# EasyEDA Pro project ProPrj_USB Hub Port PCB_2026-08-16.epro

# Schematic Schematic1
Board Name: Board1; Create Date: 2026-04-19; Page Name: P1; Project Name: USB Hub Port PCB; Schematic Name: Schematic1; Update Date: 2026-04-21; Company: EasyEDA.com; Page Size: A4; Version: V1.0
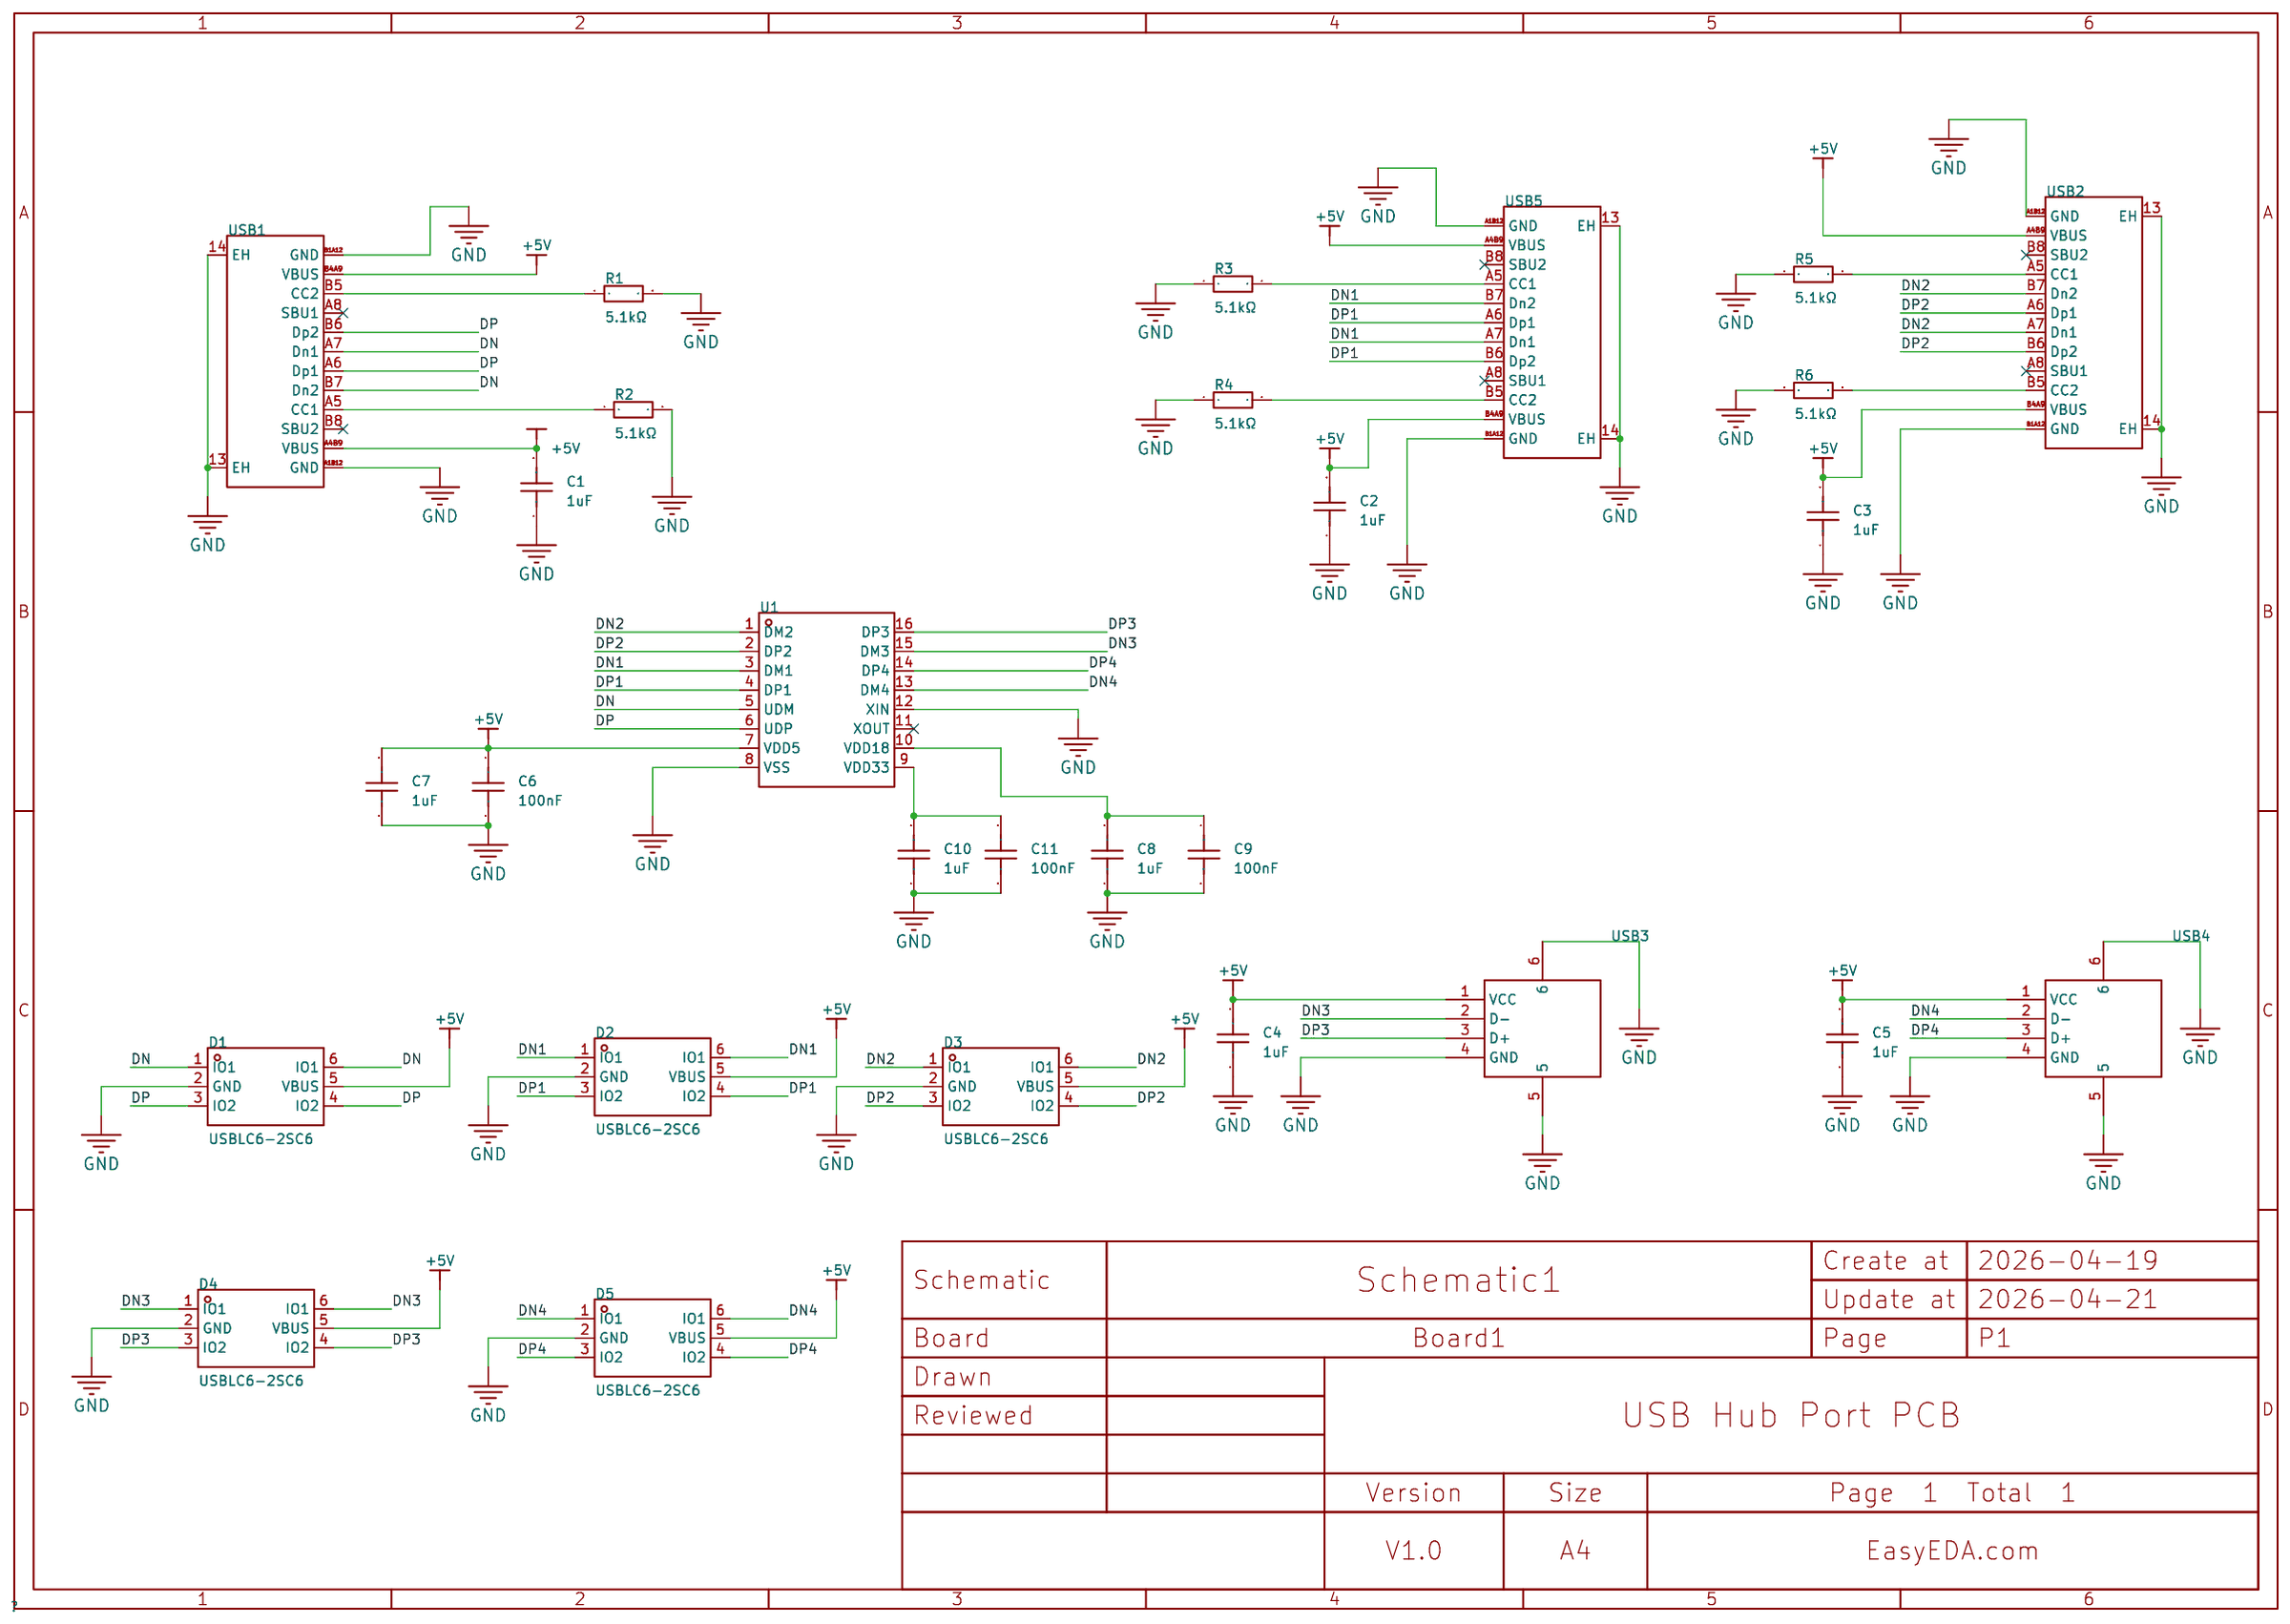
[diagram p0: schematic sheet]

## Parts
C1  1uF  [C0603]
C2  1uF  [C0603]
C3  1uF  [C0603]
C4  1uF  [C0603]
C5  1uF  [C0603]
C6  100nF  [C0603]
C7  1uF  [C0603]
C8  1uF  [C0603]
C9  100nF  [C0603]
C10  1uF  [C0603]
C11  100nF  [C0603]
D1  USBLC6-2SC6  [SOT-23-6_L2.9-W1.6-P0.95-LS2.8-BL]
D2  USBLC6-2SC6  [SOT-23-6_L2.9-W1.6-P0.95-LS2.8-BL]
D3  USBLC6-2SC6  [SOT-23-6_L2.9-W1.6-P0.95-LS2.8-BL]
D4  USBLC6-2SC6  [SOT-23-6_L2.9-W1.6-P0.95-LS2.8-BL]
D5  USBLC6-2SC6  [SOT-23-6_L2.9-W1.6-P0.95-LS2.8-BL]
R1  5.1kΩ  [R0603]
R2  5.1kΩ  [R0603]
R3  5.1kΩ  [R0603]
R4  5.1kΩ  [R0603]
R5  5.1kΩ  [R0603]
R6  5.1kΩ  [R0603]
U1  SL2.1s  [SSOP-16_L4.6-W2.6-P0.53-LS4.0-BL]
USB1  TYPE-C 16PIN 2MD(073)  [USB-C-SMD_TYPE-C-16PIN-2MD-073]
USB2  TYPE-C 16PIN 2MD(073)  [USB-C-SMD_TYPE-C-16PIN-2MD-073]
USB3  10.0 QHHTZB6.3  [USB-A-TH_10.0QHHTZB6.3]
USB4  10.0 QHHTZB6.3  [USB-A-TH_10.0QHHTZB6.3]
USB5  TYPE-C 16PIN 2MD(073)  [USB-C-SMD_TYPE-C-16PIN-2MD-073]

## Library data of the parts
C1-C5 C7 C8 C10 = CL10A105KB8NNNC: Capacitance:1uF Tolerance:±10% Tolerance:±10% Voltage Rating:50V Temperature Coefficient:X5R; LCSC Part Name: 1uF ±10% 50V; Supplier Part: C15849; Manufacturer: SAMSUNG(三星); Supplier Footprint: 0603; JLCPCB Part Class: Basic Part; Datasheet: https://item.szlcsc.com/datasheet/CL10A105KB8NNNC/16531.html; Supplier: LCSC; Tolerance: ±10%; Voltage Rating: 50V; Temperature Coefficient: X5R; PCB Layer: TopLayer
C6 C9 C11 = CL10B104KB8NNNC: Capacitance:100nF Tolerance:±10% Tolerance:±10% Voltage Rating:50V Temperature Coefficient:X7R; LCSC Part Name: 100nF ±10% 50V; Supplier Part: C1591; Manufacturer: SAMSUNG(三星); Supplier Footprint: 0603; JLCPCB Part Class: Extended Part; Datasheet: https://item.szlcsc.com/datasheet/CL10B104KB8NNNC/1943.html; Supplier: LCSC; Tolerance: ±10%; Voltage Rating: 50V; Temperature Coefficient: X7R; PCB Layer: TopLayer
D1-D5 = USBLC6-2SC6_C2827654: Polarity:Unidirectional Reverse Stand-Off Voltage (Vrwm):5V Clamping Voltage:12V Peak Pulse Current (Ipp):6A Peak Pulse Power Dissipation (Ppp):150W Voltage - Breakdown:6V Reverse Leakage Current (Ir):80nA Number of Channels:2 Operating Temperature:-55℃~+; LCSC Part Name: ESD，可防30kV静电; Supplier Part: C2827654; Manufacturer: TECH PUBLIC(台舟); Supplier Footprint: SOT-23-6; JLCPCB Part Class: Extended Part; Datasheet: https://item.szlcsc.com/datasheet/USBLC6-2SC6/2973336.html; Supplier: LCSC; Polarity: Unidirectional; Reverse Stand-Off Voltage (Vrwm): 5V; Clamping Voltage: 12V; Peak Pulse Current (Ipp): 6A; Peak Pulse Power Dissipation (Ppp): 150W; Voltage - Breakdown: 6V; Reverse Leakage Current (Ir): 80nA; Number of Channels: 2; Operating Temperature: -55℃~+125℃; level of protection: IEC 61000-4-2；IEC 61000-4-4；IEC 61000-4-5; Type: ESD; Junction Capacitance: 0.35pF
R1-R6 = 0603WAF5101T5E: Type:Thick Film Resistor Resistance:5.1kΩ Tolerance:±1% Tolerance:±1% Power(Watts):100mW Voltage-Supply(Max):75V Temperature Coefficient:±100ppm/℃ Temperature Coefficient:±100ppm/℃ Operating Temperature:-55℃~+155℃ Operating Temperature:-55℃~+155℃; LCSC Part Name: 5.1kΩ ±1% 100mW 厚膜电阻; Supplier Part: C23186; Manufacturer: UNI-ROYAL(厚声); Supplier Footprint: 0603; JLCPCB Part Class: Basic Part; Datasheet: https://item.szlcsc.com/datasheet/0603WAF5101T5E/23913.html; Supplier: LCSC; Type: Thick Film Resistor; Tolerance: ±1%; Power(Watts): 100mW; Voltage-Supply(Max): 75V; Temperature Coefficient: ±100ppm/℃; Operating Temperature: -55℃~+155℃
U1 = SL2.1s: type:Hub USB Protocol:USB 2.0 Data Rate:- Voltage - Supply:4V~5.25V Voltage - Supply:4V~5.25V Operating Temperature:0℃~+70℃ Operating Temperature:0℃~+70℃ Memory Interface:- Current - Supply:120mA Quiescent Supply Current:2.5mA Number of Channels:4; LCSC Part Name: USB2.0 HUB控制器集成电路; Supplier Part: C2684433; Manufacturer: CoreChips(和芯润德); Supplier Footprint: SSOP-16; JLCPCB Part Class: Extended Part; Datasheet: https://item.szlcsc.com/datasheet/SL2.1s/2782346.html; Supplier: LCSC; type: Hub; USB Protocol: USB 2.0; Voltage - Supply: 4V~5.25V; Operating Temperature: 0℃~+70℃; Current - Supply: 120mA; Quiescent Supply Current: 2.5mA; Number of Channels: 4
USB1 USB2 USB5 = TYPE-C 16PIN 2MD(073): Connector Type:Type-C Protocol Standard:- Gender:Female Mounting Type:Surface Mount, Right Angle Number of Contacts:16P Number of Ports:1 Current Rating-Power:3A Voltage Rating:5V Connect-Disconnect Life:10,000 cycles Supplementary Features:- Center Heigh; LCSC Part Name: Type-C 母 卧贴; Supplier Part: C2765186; Manufacturer: SHOU HAN(首韩); Supplier Footprint: SMD; JLCPCB Part Class: Extended Part; Datasheet: https://item.szlcsc.com/datasheet/TYPE-C%252016PIN%25202MD(073)/2901843.html; Supplier: LCSC; Connector Type: Type-C; Gender: Female; Mounting Type: Surface Mount, Right Angle; Number of Contacts: 16P; Number of Ports: 1; Current Rating-Power: 3A; Voltage Rating: 5V; Connect-Disconnect Life: 10,000 cycles; Detection color: Black; Operating Temperature: -25℃~+85℃
USB3 USB4 = 10.0 QHHTZB6.3: Connector Type:Type-A Protocol Standard:USB 2.0 Gender:Female Mounting Type:Surface Mount, Right Angle Number of Contacts:4P Number of Ports:1 Current Rating-Power:1.5A Voltage Rating:30V Connect-Disconnect Life:5,000 times Supplementary Features:- Center; LCSC Part Name: 壳长10.0mm; Supplier Part: C668591; Manufacturer: SHOU HAN(首韩); Supplier Footprint: SMD; JLCPCB Part Class: Extended Part; Datasheet: https://item.szlcsc.com/datasheet/10.0%2520QHHTZB6.3/698534.html; Supplier: LCSC; Connector Type: Type-A; Protocol Standard: USB 2.0; Gender: Female; Mounting Type: Surface Mount, Right Angle; Number of Contacts: 4P; Number of Ports: 1; Current Rating-Power: 1.5A; Voltage Rating: 30V; Connect-Disconnect Life: 5,000 times; Length: 10mm; Detection color: Black; Operating Temperature: -25℃~+85℃

## Nets
+5V: C1.2 C2.2 C3.2 C4.2 C5.2 C6.1 C7.2 D1.5(VBUS) D2.5(VBUS) D3.5(VBUS) D4.5(VBUS) D5.5(VBUS) U1.7(VDD5) USB1.A4B9(VBUS) USB1.B4A9(VBUS) USB2.A4B9(VBUS) USB2.B4A9(VBUS) USB3.1(VCC) USB4.1(VCC) USB5.A4B9(VBUS) USB5.B4A9(VBUS)
GND: C1.1 C2.1 C3.1 C4.1 C5.1 C6.2 C7.1 C8.1 C9.2 C10.1 C11.2 D1.2(GND) D2.2(GND) D3.2(GND) D4.2(GND) D5.2(GND) R1.2 R2.2 R3.1 R4.1 R5.1 R6.1 U1.8(VSS) U1.12(XIN) USB1.13(EH) USB1.14(EH) USB1.A1B12(GND) USB1.B1A12(GND) USB2.13(EH) USB2.14(EH) USB2.A1B12(GND) USB2.B1A12(GND) USB3.4(GND) USB3.5 USB3.6 USB4.4(GND) USB4.5 USB4.6 USB5.13(EH) USB5.14(EH) USB5.A1B12(GND) USB5.B1A12(GND)
DN: D1.1(IO1) D1.6(IO1) U1.5(UDM) USB1.A7(Dn1) USB1.B7(Dn2)
DN1: D2.1(IO1) D2.6(IO1) U1.3(DM1) USB5.A7(Dn1) USB5.B7(Dn2)
DN2: D3.1(IO1) D3.6(IO1) U1.1(DM2) USB2.A7(Dn1) USB2.B7(Dn2)
DN3: D4.1(IO1) D4.6(IO1) U1.15(DM3) USB3.2(D-)
DN4: D5.1(IO1) D5.6(IO1) U1.13(DM4) USB4.2(D-)
DP: D1.3(IO2) D1.4(IO2) U1.6(UDP) USB1.A6(Dp1) USB1.B6(Dp2)
DP1: D2.3(IO2) D2.4(IO2) U1.4(DP1) USB5.A6(Dp1) USB5.B6(Dp2)
DP2: D3.3(IO2) D3.4(IO2) U1.2(DP2) USB2.A6(Dp1) USB2.B6(Dp2)
DP3: D4.3(IO2) D4.4(IO2) U1.16(DP3) USB3.3(D+)
DP4: D5.3(IO2) D5.4(IO2) U1.14(DP4) USB4.3(D+)
$1N1031: R1.1 USB1.B5(CC2)
$1N1035: R2.1 USB1.A5(CC1)
$1N1639: R3.2 USB5.A5(CC1)
$1N1643: R4.2 USB5.B5(CC2)
$1N2417: R6.2 USB2.B5(CC2)
$1N2458: R5.2 USB2.A5(CC1)
$1N2907: C8.2 C9.1 U1.10(VDD18)
$1N3014: C10.2 C11.1 U1.9(VDD33)

Not connected (* = marked no-connect by the designer): U1 11(XOUT)*; USB1 A8(SBU1)* B8(SBU2)*; USB2 A8(SBU1)* B8(SBU2)*; USB5 A8(SBU1)* B8(SBU2)*

# Board PCB1
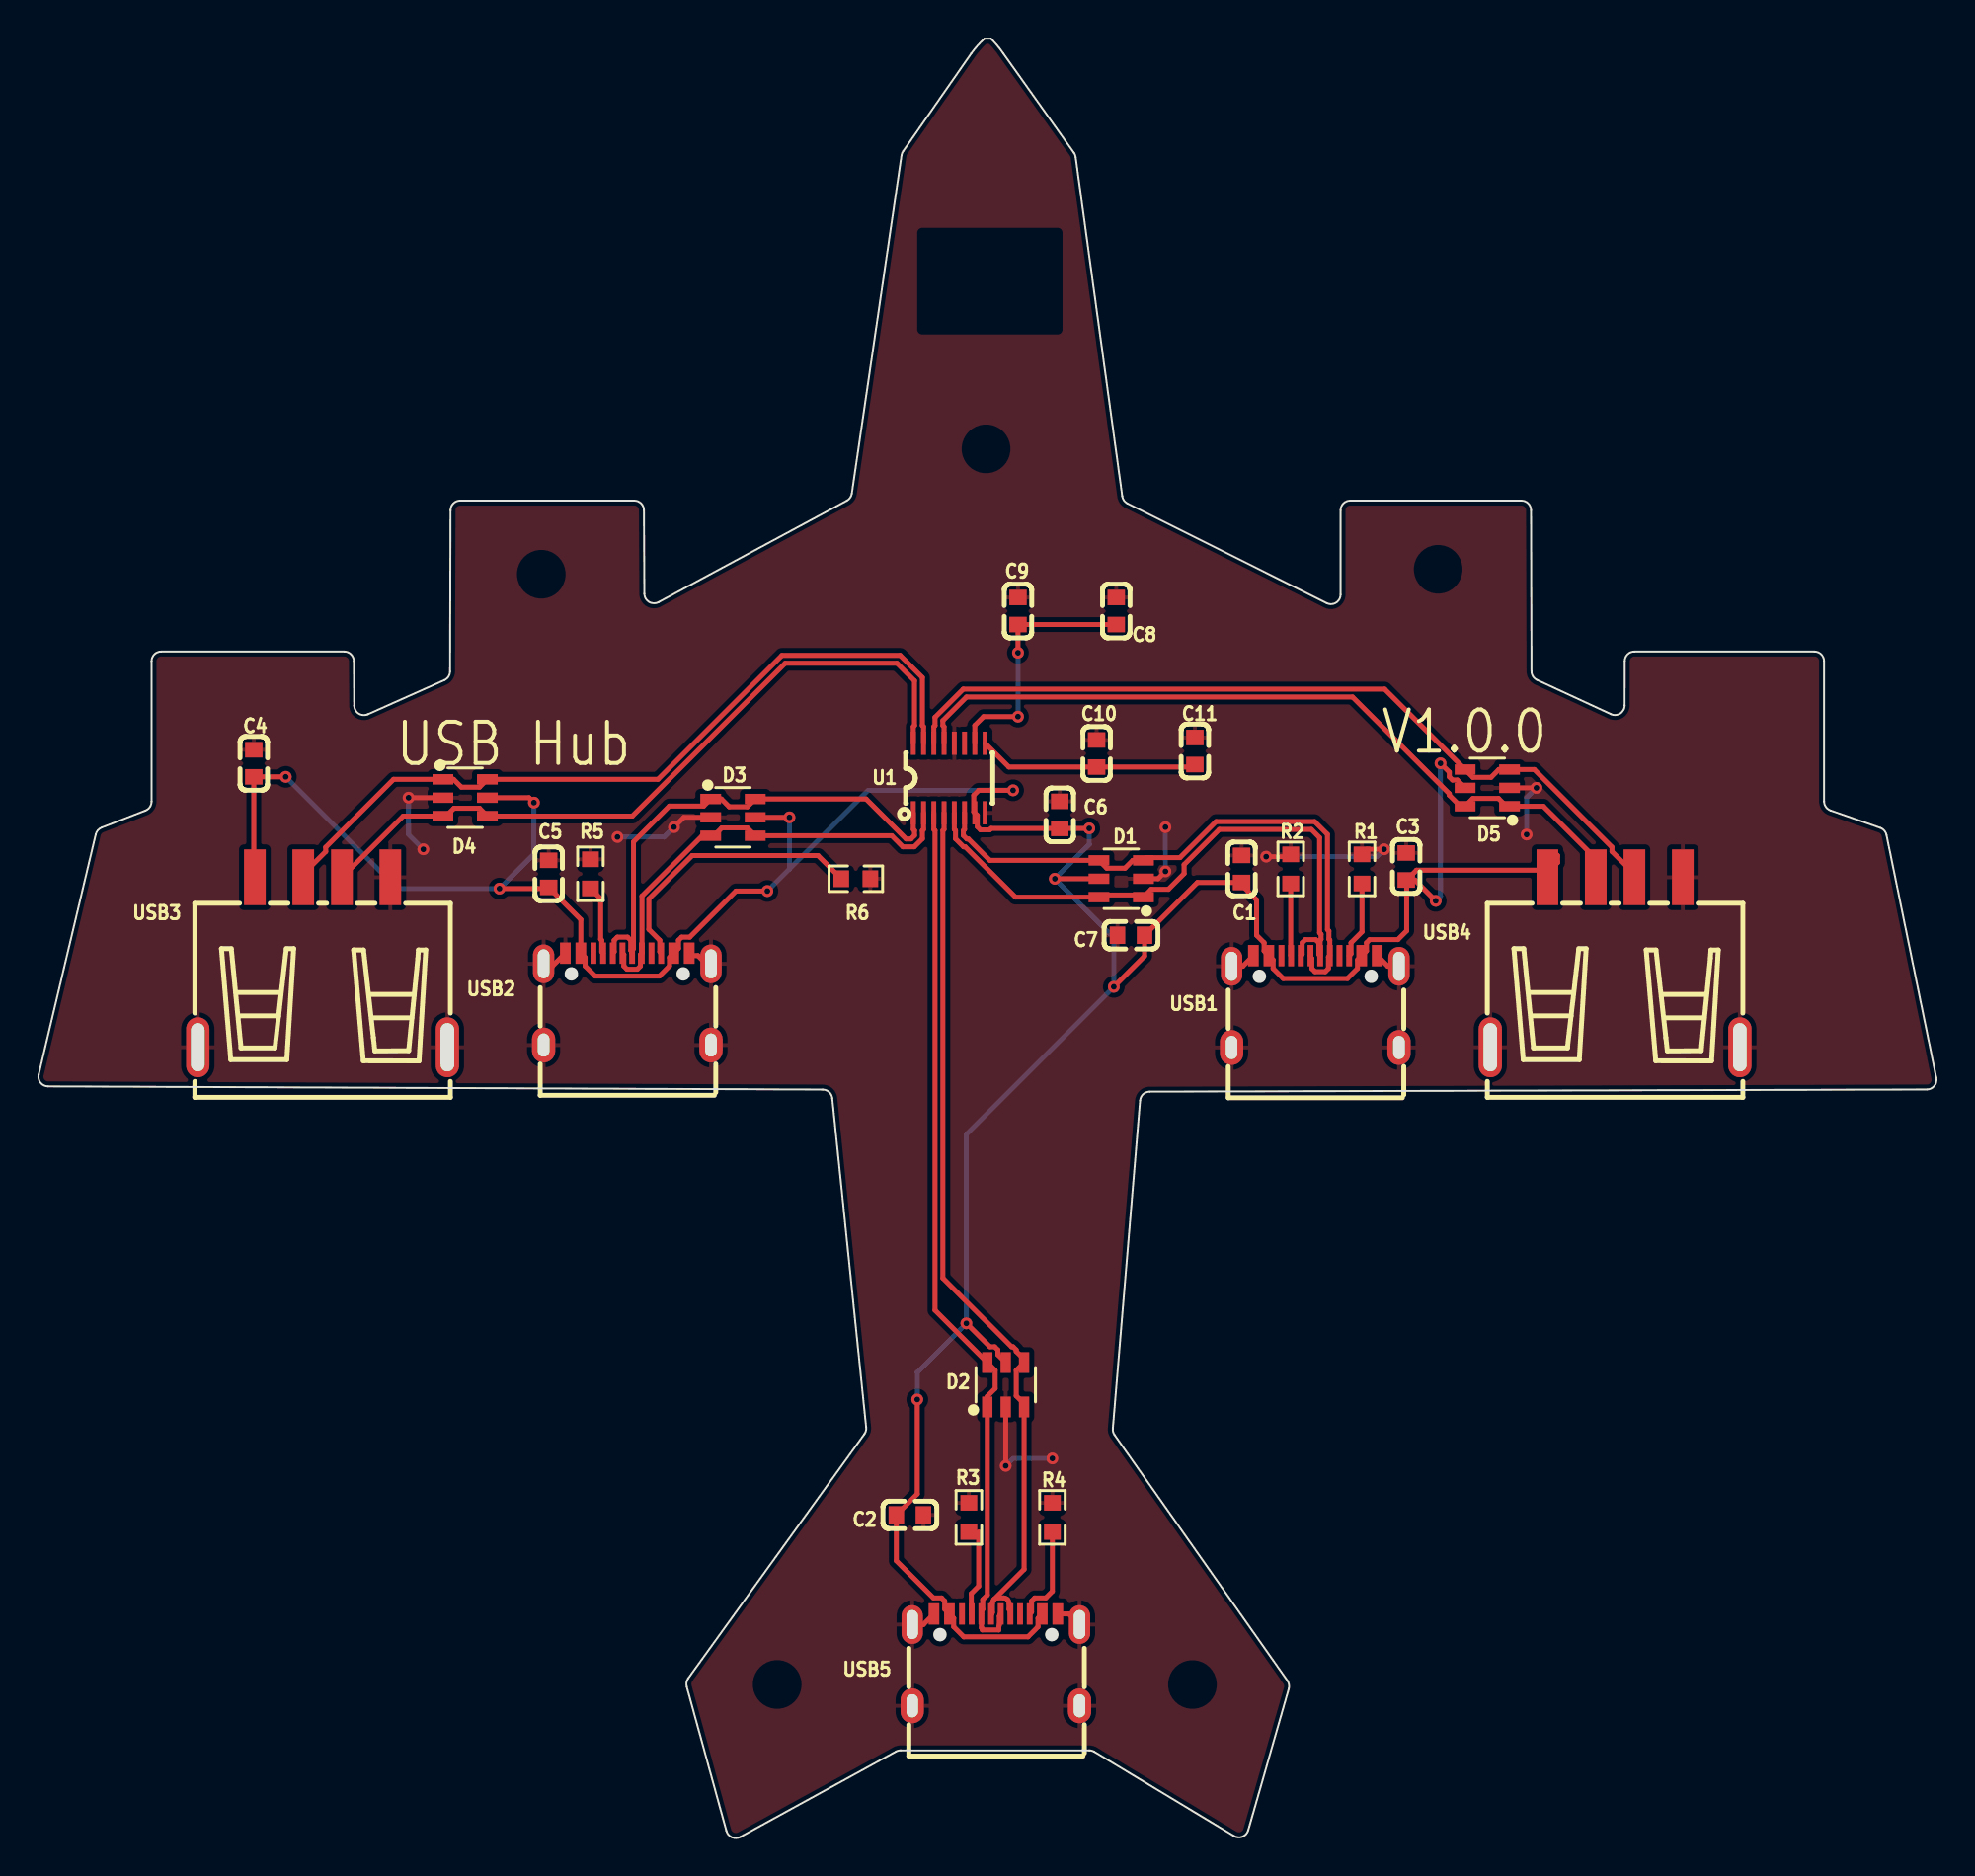
[diagram p1: board, top side]
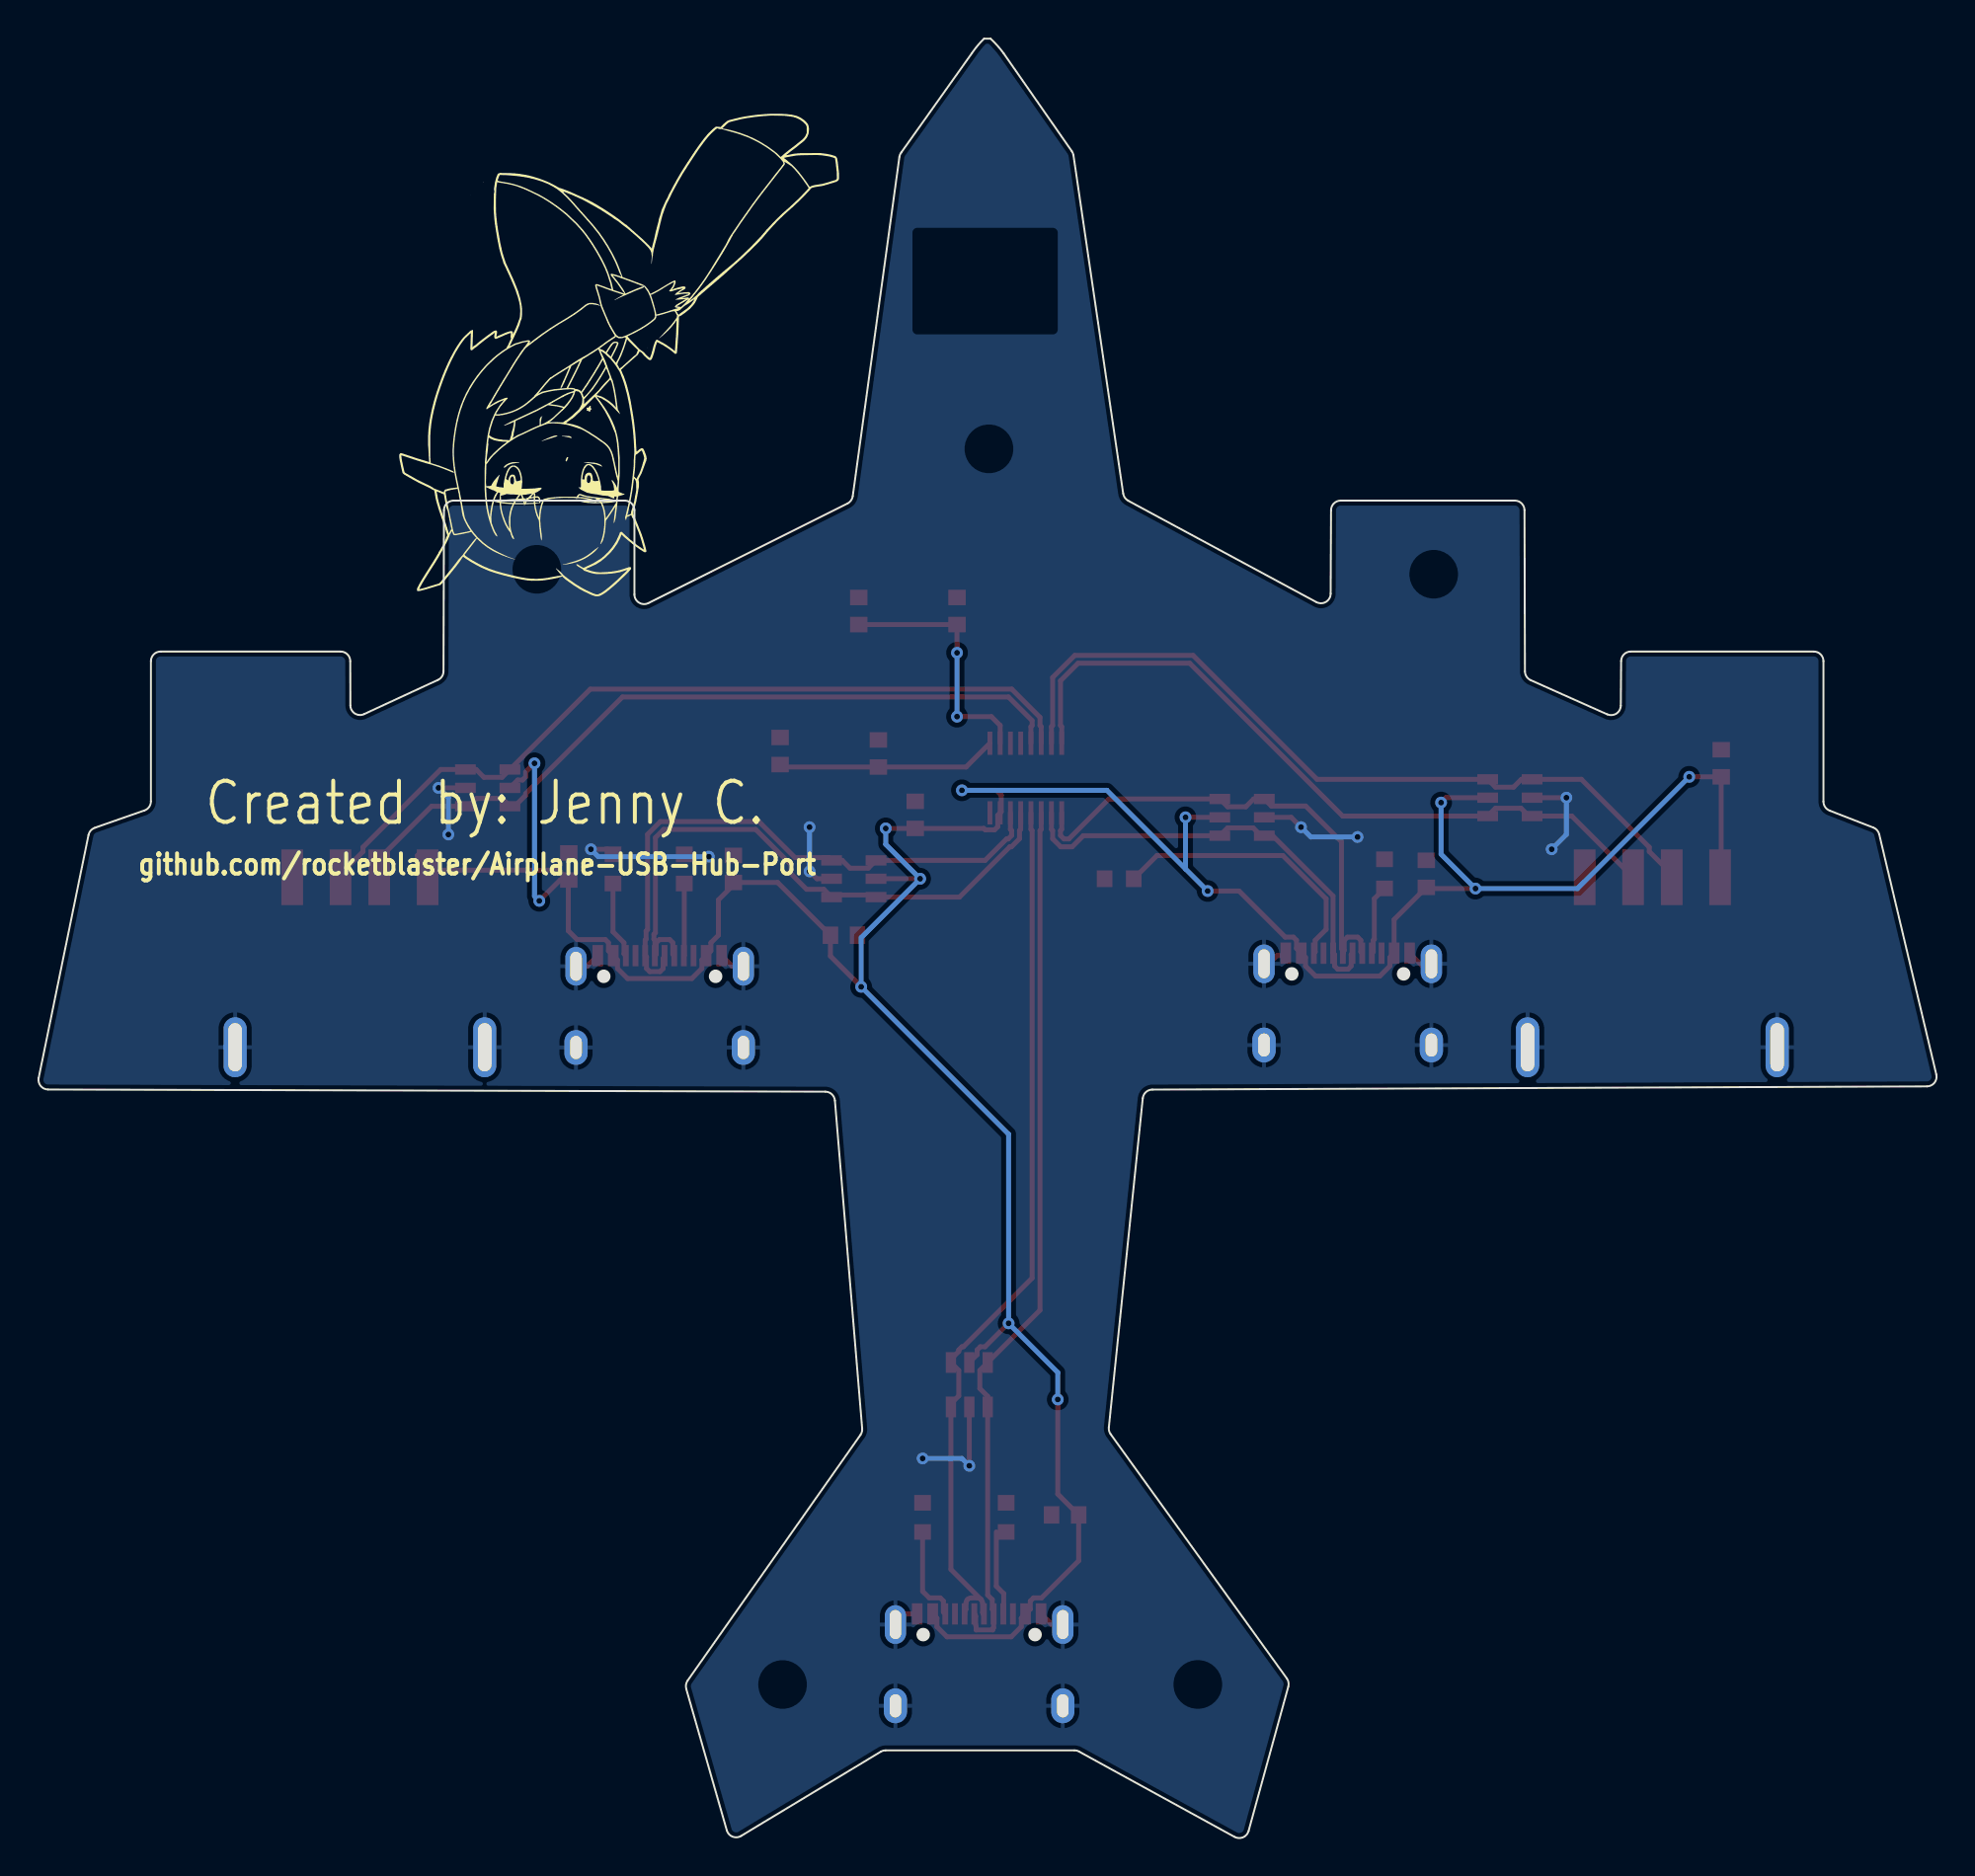
[diagram p2: board, bottom side, seen from below]

Outline 98.08 x 93 mm; copper layers: Top Layer, Bottom Layer. Coordinates in mm from the lower left corner of the outline.
Outline path: 0.48,38.83 arc(0.09,39.02) 0,39.44 2.95,51.86 arc(3.06,52.07) 3.25,52.21 5.51,53.09 arc(5.75,53.27) 5.83,53.55 5.83,60.81 arc(5.98,61.16) 6.33,61.31 15.79,61.31 arc(16.14,61.16) 16.29,60.81 16.31,58.52 arc(16.54,58.1) 17.01,58.06 20.97,59.83 arc(21.18,60.01) 21.26,60.29 21.28,68.61 arc(21.43,68.97) 21.78,69.11 30.78,69.11 arc(31.14,68.97) 31.28,68.62 31.3,64.3 arc(31.55,63.88) 32.04,63.87 41.77,69.11 arc(41.94,69.26) 42.03,69.48 44.6,86.96 arc(44.63,87.08) 44.69,87.19 48.2,92.23 arc(48.52,92.63) 48.88,93 49.22,93 arc(49.55,92.63) 49.85,92.23 53.5,87.11 arc(53.56,87) 53.59,86.88 56,69.34 arc(56.09,69.12) 56.28,68.96 66.56,63.81 arc(67.05,63.84) 67.29,64.26 67.29,68.61 arc(67.43,68.97) 67.79,69.11 76.63,69.11 arc(76.98,68.97) 77.13,68.61 77.16,60.29 arc(77.23,60.02) 77.45,59.84 81.26,58.07 arc(81.74,58.11) 81.97,58.53 81.97,60.81 arc(82.12,61.16) 82.47,61.31 91.78,61.31 arc(92.13,61.16) 92.28,60.81 92.28,53.56 arc(92.37,53.27) 92.61,53.09 95.18,52.2 arc(95.39,52.05) 95.5,51.82 98.08,39.27 arc(97.98,38.85) 97.59,38.66 57.42,38.55 arc(57.08,38.42) 56.93,38.09 55.52,21.13 arc(55.53,20.96) 55.61,20.8 64.54,8.1 arc(64.62,7.9) 64.61,7.68 62.51,0.36 arc(62.22,0.03) 61.77,0.07 54.56,4.42 arc(54.43,4.48) 54.3,4.5 44.55,4.5 arc(44.42,4.48) 44.3,4.43 36.27,0.02 arc(35.83,0) 35.54,0.33 33.49,7.79 arc(33.48,8.01) 33.57,8.22 42.68,20.85 arc(42.75,21.01) 42.77,21.19 41.01,38.21 arc(40.85,38.53) 40.52,38.66 0.48,38.83
Stack: Top Layer 0.035mm / Dielectric1 1.51mm FR4 er 4.5 / Bottom Layer 0.035mm

## Design rules (mm)
net DN2: DP5
net DP2: DP5
net DN1: DP1
net DP1: DP1
net DN: DP2
net DP: DP2
net DP4: DP4
net DP3: DP3
net DN3: DP3
net DN4: DP4
spacing copperThickness1oz (default): track to track 0.102, other pairs 0.152 to 0.3
spacing copperThickness2oz: track to track 0.203, other pairs 0.152 to 0.3
spacing Plane_innerPlane: track to track 0.102, other pairs 0.152 to 0.3
spacing Copper_copperRegion: track to track 0.102, other pairs 0.152 to 0.3
track width copperThickness1oz (default): min 0.127, default 0.254, max 2.54
track width copperThickness2oz: min 0.203, default 0.254, max 2.54
differential pair differentialPair (default): width min 0.127, default 0.254, max 2.54; gap min 0.152, default 0.152
pour e162 uses Copper_copperRegion
pour e224 uses Copper_copperRegion

## Placement (name value [footprint] x y rotation side)
C1  1uF  [C0603]  62.17 50.07 270 top
C2  1uF  [C0603]  45.03 16.67 180 top
C3  1uF  [C0603]  70.68 50.2 270 top
C4  1uF  [C0603]  11.12 55.53 270 top
C5  1uF  [C0603]  26.36 49.82 270 top
C6  100nF  [C0603]  52.77 52.86 90 top
C7  1uF  [C0603]  56.46 46.64 0 top
C8  1uF  [C0603]  55.69 63.4 270 top
C9  100nF  [C0603]  50.61 63.4 90 top
C10  1uF  [C0603]  54.68 56.04 270 top
C11  100nF  [C0603]  59.76 56.17 90 top
D1  USBLC6-2SC6  [SOT-23-6_L2.9-W1.6-P0.95-LS2.8-BL]  55.95 49.56 90 top
D2  USBLC6-2SC6  [SOT-23-6_L2.9-W1.6-P0.95-LS2.8-BL]  49.98 23.4 0 top
D3  USBLC6-2SC6  [SOT-23-6_L2.9-W1.6-P0.95-LS2.8-BL]  35.88 52.74 270 top
D4  USBLC6-2SC6  [SOT-23-6_L2.9-W1.6-P0.95-LS2.8-BL]  22.04 53.75 270 top
D5  USBLC6-2SC6  [SOT-23-6_L2.9-W1.6-P0.95-LS2.8-BL]  74.87 54.26 90 top
R1  5.1kΩ  [R0603]  68.39 50.07 90 top
R2  5.1kΩ  [R0603]  64.71 50.07 90 top
R3  5.1kΩ  [R0603]  48.07 16.54 270 top
R4  5.1kΩ  [R0603]  52.39 16.54 270 top
R5  5.1kΩ  [R0603]  28.52 49.82 270 top
R6  5.1kΩ  [R0603]  42.23 49.56 180 top
U1  SL2.1s  [SSOP-16_L4.6-W2.6-P0.53-LS4.0-BL]  47.06 54.77 0 top
USB1  TYPE-C 16PIN 2MD(073)  [USB-C-SMD_TYPE-C-16PIN-2MD-073]  65.98 43.21 0 top
USB2  TYPE-C 16PIN 2MD(073)  [USB-C-SMD_TYPE-C-16PIN-2MD-073]  30.42 43.34 0 top
USB3  10.0 QHHTZB6.3  [USB-A-TH_10.0QHHTZB6.3]  14.67 45.24 0 top
USB4  10.0 QHHTZB6.3  [USB-A-TH_10.0QHHTZB6.3]  81.48 45.24 0 top
USB5  TYPE-C 16PIN 2MD(073)  [USB-C-SMD_TYPE-C-16PIN-2MD-073]  49.47 9.18 0 top

## Footprints (pads in the part's own frame, mm; a bottom-side part is the same pattern mirrored in y, then rotated)
C0603
  rect 0.8x0.9 smd: 1(-0.7,0) 2(0.7,0)
R0603
  rect 0.806x0.864 smd: 1(-0.753,0) 2(0.753,0)
SOT-23-6_L2.9-W1.6-P0.95-LS2.8-BL
  rect 0.532x1.072 smd: 1(-0.95,-1.149) 2(0,-1.149) 3(0.95,-1.149) 4(0.95,1.149) 5(0,1.149) 6(-0.95,1.149)
SSOP-16_L4.6-W2.6-P0.53-LS4.0-BL
  rect 0.25x1.2 smd: 1(-1.855,-1.8) 2(-1.325,-1.8) 3(-0.795,-1.8) 4(-0.265,-1.8) 5(0.265,-1.8) 6(0.795,-1.8) 7(1.325,-1.8) 8(1.855,-1.8) 9(1.855,1.8) 10(1.325,1.8) 11(0.795,1.8) 12(0.265,1.8) 13(-0.265,1.8) 14(-0.795,1.8) 15(-1.325,1.8) 16(-1.855,1.8)
USB-A-TH_10.0QHHTZB6.3
  rect 1.12x2.88 smd: 1(-3.5,4.395) 2(-1,4.395) 3(1,4.395) 4(3.5,4.395)
  oval 1.2x3.1 hole 0.7x2.5: 5(-6.45,-4.395) 6(6.45,-4.395)
USB-C-SMD_TYPE-C-16PIN-2MD-073
  oval 1.1x2 hole 0.6x1.5: 13(-4.325,1.825) 14(4.325,1.825)
  oval 1.2x1.8 hole 0.6x1.2: 13(-4.325,-2.375) 14(4.325,-2.375)
  rect 0.55x1.1 smd: A1B12(-3.2,2.375) A4B9(-2.4,2.375) B1A12(3.2,2.375) B4A9(2.4,2.375)
  rect 0.3x1.1 smd: A5(-1.25,2.375) A6(-0.25,2.375) A7(0.25,2.375) A8(1.25,2.375) B5(1.75,2.375) B6(0.75,2.375) B7(-0.75,2.375) B8(-1.75,2.375)

## Nets
As in the schematic.

Pads without a net: U1 11; USB1 A8 B8; USB2 A8 B8; USB5 A8 B8

## Via types
v1: diameter 0.61, hole 0.305, Top Layer to Bottom Layer, 27 vias

## Routing (per net, layer and track width the routed paths; a pad name or vN(x,y) marks a point on that pad's centre or on a via; arc(x,y) is an arc through that point)
+5V: length 182.8
  Top Layer w0.254: D5.5 73.32,54.67 73.07,54.67 72.91,54.83 72.91,55.08 v1(72.45,55.53) ; v1(12.77,54.83) C4.2 11.12,49.69 USB3.1 ; v1(47.95,26.57) 47.95,26.57 49.16,25.36 49.41,25.36 49.57,25.2 49.57,24.95 D2.5 ; v1(52.52,49.56) D1.5 ; v1(54.3,52.16) C6.1 49.23,52.16 49.15,52.09 48.67,52.09 48.51,52.25 48.51,52.84 U1.7 48.33,53.02 48.33,53.88 48.58,54.13 v1(50.36,54.13) ; 70.7,49.5 71.13,49.5 v1(72.2,48.42) ; 70.7,49.5 C3.2 ; 70.7,49.5 70.7,46.87 70.25,46.42 68.79,46.42 68.63,46.25 68.63,45.83 USB1.B4A9 68.16,45.37 68.16,44.92 67.64,44.4 64.32,44.4 63.8,44.92 63.8,45.37 USB1.A4B9 63.34,45.83 63.34,46.25 62.95,46.64 62.95,48.47 62.17,49.24 C1.2 59.89,49.37 57.16,46.64 57.16,45.56 v1(55.57,43.97) ; 70.7,49.5 71.21,50 78.11,50 78.51,50.4 78.51,50.76 78.36,50.91 77.98,50.91 ; v1(45.41,22.64) 45.41,17.75 44.33,16.67 44.33,14.3 46.24,12.38 46.66,12.38 46.83,12.22 46.83,11.8 USB5.A4B9 47.29,11.33 47.29,10.89 47.81,10.37 51.13,10.37 51.65,10.89 51.65,11.33 USB5.B4A9 ; v1(37.66,48.93) 36.03,48.93 33.65,46.54 33.23,46.54 33.07,46.38 33.07,45.96 USB2.B4A9 32.6,45.49 32.6,45.05 32.08,44.53 28.76,44.53 28.24,45.05 28.24,45.49 USB2.A4B9 28.02,47.45 C5.2 26.3,49.05 v1(23.82,49.05) ; D4.5 25.34,53.75 v1(25.6,53.5) ; D3.5 v1(38.8,52.74)
  Bottom Layer w0.254: 38.8,50.07 v1(37.66,48.93) ; 38.8,50.07 42.87,54.13 v1(50.36,54.13) ; 38.8,50.07 v1(38.8,52.74) ; v1(45.41,22.64) 45.41,24.03 v1(47.95,26.57) 47.95,36.35 v1(55.57,43.97) 55.57,46.51 v1(52.52,49.56) 54.3,51.34 v1(54.3,52.16) ; v1(12.77,54.83) 18.55,49.05 v1(23.82,49.05) 25.6,50.83 v1(25.6,53.5) ; v1(72.45,55.53) 72.45,48.67 v1(72.2,48.42)
GND: length 40.2
  Top Layer w0.254: USB1.14 69.73,45.04 USB1.B1A12 ; v1(69.54,51.09) 68.66,51.09 R1.2 ; USB5.A1B12 45.72,11 45.15,11 ; USB1.13 62.23,45.04 USB1.A1B12 ; 25.97,45.04 26.54,45.04 27.09,45.59 ; v1(58.23,52.23) 58.18,52.28 ; 34.62,45.04 34.07,45.59 33.49,45.59 ; v1(32.83,52.23) 33.34,52.74 D3.2 ; 53.8,11 53.25,11.55 USB5.B1A12 ; R2.2 64.59,50.7 v1(63.44,50.7) ; D4.2 v1(19.12,53.75) ; D1.2 57.85,49.56 v1(58.23,49.94) ; D2.2 v1(49.98,19.21) ; D5.2 v1(77.41,54.26)
  Bottom Layer w0.254: v1(63.44,50.7) 69.16,50.7 v1(69.54,51.09) ; v1(29.91,51.72) 32.33,51.72 v1(32.83,52.23) ; v1(19.12,53.75) 19.12,51.85 v1(19.88,51.09) ; v1(77.41,54.26) 76.9,53.75 v1(76.9,51.85) ; v1(52.39,19.59) 50.36,19.59 v1(49.98,19.21) ; v1(58.23,49.94) v1(58.23,52.23)
DN: length 32
  Top Layer w0.254: U1.5 47.32,52.11 47.39,52.05 47.39,51.63 47.8,51.21 47.89,51.21 50.49,48.61 D1.6 54.91,48.72 56.82,48.72 56.93,48.61 D1.1 57.5,49.02 58.39,49.02 59.2,49.83 59.2,50.29 61.02,52.11 65.78,52.11 66.2,51.69 66.2,46.77 66.28,46.69 66.28,46.44 66.23,46.39 USB1.A7 66.16,45.66 66.16,46.25 66,46.42 65.47,46.42 65.3,46.25 65.3,45.66 USB1.B7
DN1: length 45.6
  Top Layer w0.254: U1.3 46.26,52.11 46.33,52.05 46.33,27.25 D2.6 49.43,24.14 49.43,23.21 49.03,22.8 D2.1 49.03,12.53 48.79,12.29 48.79,11.79 48.72,11.72 USB5.B7 48.72,10.84 48.77,10.79 48.77,10.72 49.62,10.72 49.62,10.88 arc(49.64,10.94) 49.65,11 49.65,11.43 arc(49.67,11.47) 49.68,11.51 USB5.A7
DN2: length 26.1
  Top Layer w0.254: U1.1 45.2,52.11 45.27,52.05 45.27,51.8 45.09,51.62 44.83,51.62 42.76,53.69 D3.6 36.63,53.28 35.69,53.28 35.28,53.69 D3.1 34.37,53.32 32.59,53.32 30.74,51.47 30.74,45.95 30.67,45.88 USB2.A7 30.65,45.74 30.65,45.81 30.6,45.86 30.6,46.38 30.44,46.54 29.91,46.54 29.74,46.38 29.74,45.78 USB2.B7
DN3: length 41.2
  Top Layer w0.254: U1.15 45.73,57.42 45.67,57.48 45.67,59.97 44.53,61.11 38.41,61.11 32.01,54.7 D4.6 22.78,54.3 21.85,54.3 21.44,54.7 D4.1 18.34,54.7 14.83,51.19 14.83,50.97 13.67,49.81 USB3.2
DN4: length 40.3
  Top Layer w0.254: U1.13 46.79,57.42 46.73,57.48 46.73,57.74 47.95,58.96 67.91,58.96 72.91,53.96 72.91,53.88 73.48,53.31 D5.6 74.13,53.72 75.45,53.72 75.85,53.31 D5.1 77.77,53.31 80.48,50.6 USB4.2
DP: length 30.7
  Top Layer w0.254: USB1.A6 65.75,45.56 65.75,45.49 65.8,45.44 65.8,44.92 65.97,44.76 66.5,44.76 66.66,44.92 66.66,45.52 USB1.B6 66.73,46.39 66.68,46.44 66.68,46.86 66.61,46.94 66.61,51.86 65.95,52.52 60.85,52.52 58.99,50.65 57.24,50.65 D1.3 56.55,50.51 56.14,50.11 55.2,50.11 D1.4 49.16,50.51 48.05,51.62 47.97,51.62 47.79,51.8 47.79,52.05 47.85,52.11 U1.6
DP1: length 45.8
  Top Layer w0.254: USB5.B6 50.22,11.72 50.15,11.79 50.15,12.1 arc(50.13,12.21) 50.07,12.3 arc(49.98,12.36) 49.87,12.38 49.57,12.38 arc(49.46,12.36) 49.37,12.3 ; USB5.A6 49.26,11.55 arc(49.28,11.59) 49.29,11.62 49.29,12.1 arc(49.31,12.21) 49.37,12.3 ; 49.37,12.3 50.93,13.85 D2.3 50.93,22.42 50.52,22.82 50.52,24.14 D2.4 50.93,24.72 50.52,25.12 50.52,25.2 50.36,25.36 50.28,25.36 46.73,28.91 46.73,52.05 46.79,52.11 U1.4
DP2: length 23.2
  Top Layer w0.254: USB2.A6 30.24,45.64 30.24,45.05 30.41,44.88 30.94,44.88 31.1,45.05 31.1,45.64 USB2.B6 31.18,45.72 31.18,48.67 34.3,51.79 D3.3 34.9,51.79 35.31,52.19 36.63,52.19 D3.4 44.09,51.79 44.66,51.21 45.25,51.21 45.67,51.63 45.67,52.05 45.73,52.11 U1.2
DP3: length 38.1
  Top Layer w0.254: USB3.3 18.84,52.8 D4.3 21.06,52.8 21.46,53.21 22.78,53.21 D4.4 30.68,52.8 38.58,60.7 44.36,60.7 45.27,59.8 45.27,57.48 45.2,57.42 U1.16
DP4: length 42.7
  Top Layer w0.254: USB4.3 82.48,49.81 81.31,50.97 81.31,51.19 77.3,55.21 D5.3 75.47,55.21 75.07,54.81 74.13,54.81 D5.4 69.57,59.37 47.78,59.37 46.33,57.91 46.33,57.48 46.26,57.42 U1.14
$1N1031: length 4
  Top Layer w0.254: R1.1 68.39,46.82 67.83,46.25 67.83,45.68 USB1.B5
$1N1035: length 3.7
  Top Layer w0.254: USB1.A5 64.71,45.61 R2.1
$1N1639: length 4.4
  Top Layer w0.254: USB5.A5 48.2,11.57 48.2,12.6 48.58,12.99 48.58,15.79
$1N1643: length 5.1
  Top Layer w0.254: USB5.B5 51.32,11.65 51.32,12.22 51.48,12.38 52.05,12.38 52.39,12.72 R4.2
$1N2417: length 14.4
  Top Layer w0.254: R6.2 40.28,50.76 33.78,50.76 31.54,48.52 31.54,46.94 32.1,46.38 32.1,45.78 USB2.B5
$1N2458: length 3.6
  Top Layer w0.254: R5.2 29.04,48.53 29.04,46.44 29.1,46.38 29.1,45.78 USB2.A5
$1N2907: length 13.2
  Top Layer w0.254: C8.2 C9.1 v1(50.61,61.25) ; v1(50.61,57.94) 48.84,57.94 48.38,57.49 U1.10
  Bottom Layer w0.254: v1(50.61,61.25) v1(50.61,57.94)
$1N3014: length 11.4
  Top Layer w0.254: U1.9 50.14,55.34 C10.2 59.63,55.34 C11.1

## Copper pours and planes (outline as drawn; the poured copper is in the pictures)
GND on Top Layer: -2.6,96.25 102.43,96.25 102.43,-4.03 -2.6,-4.03
GND on Bottom Layer: -2.73,98.96 102.81,98.96 102.81,-3.4 -2.73,-3.4

## Text on the board
Bottom Silkscreen Layer: github.com/rocketblaster/Airplane-USB-Hub-Port | Created by: Jenny C.
Top Silkscreen Layer: USB Hub | V1.0.0
